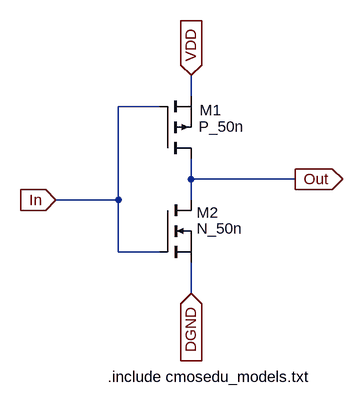
[diagram p0: schematic Inverter.asc]
Inverter.asc, the LTspice schematic file:
Version 4
SHEET 1 1024 680
WIRE 128 -672 128 -704
WIRE 80 -656 16 -656
WIRE 128 -544 128 -576
WIRE 288 -544 128 -544
WIRE 16 -512 16 -656
WIRE 16 -512 -80 -512
WIRE 128 -512 128 -544
WIRE 16 -432 16 -512
WIRE 80 -432 16 -432
WIRE 128 -368 128 -416
FLAG 288 -544 Out
IOPIN 288 -544 Out
FLAG 128 -704 VDD
IOPIN 128 -704 In
FLAG -80 -512 In
IOPIN -80 -512 In
FLAG 128 -368 DGND
IOPIN 128 -368 In
SYMBOL nmos 80 -512 R0
WINDOW 3 57 44 Left 2
WINDOW 0 57 19 Left 2
SYMATTR Value N_50n
SYMATTR InstName M2
SYMBOL pmos 80 -576 M180
WINDOW 3 60 49 Left 2
WINDOW 0 61 74 Left 2
SYMATTR Value P_50n
SYMATTR InstName M1
TEXT 0 -240 Left 2 !.include cmosedu_models.txt

The netlist it stands for:
* Inverter.asc
M2 Out In DGND DGND N_50n
M1 Out In VDD VDD P_50n
.model NMOS NMOS
.model PMOS PMOS
.lib standard.mos
.include cmosedu_models.txt
.backanno
.end